# Altium schematic sheet hardware_ProjectFish.SchDoc
size A3
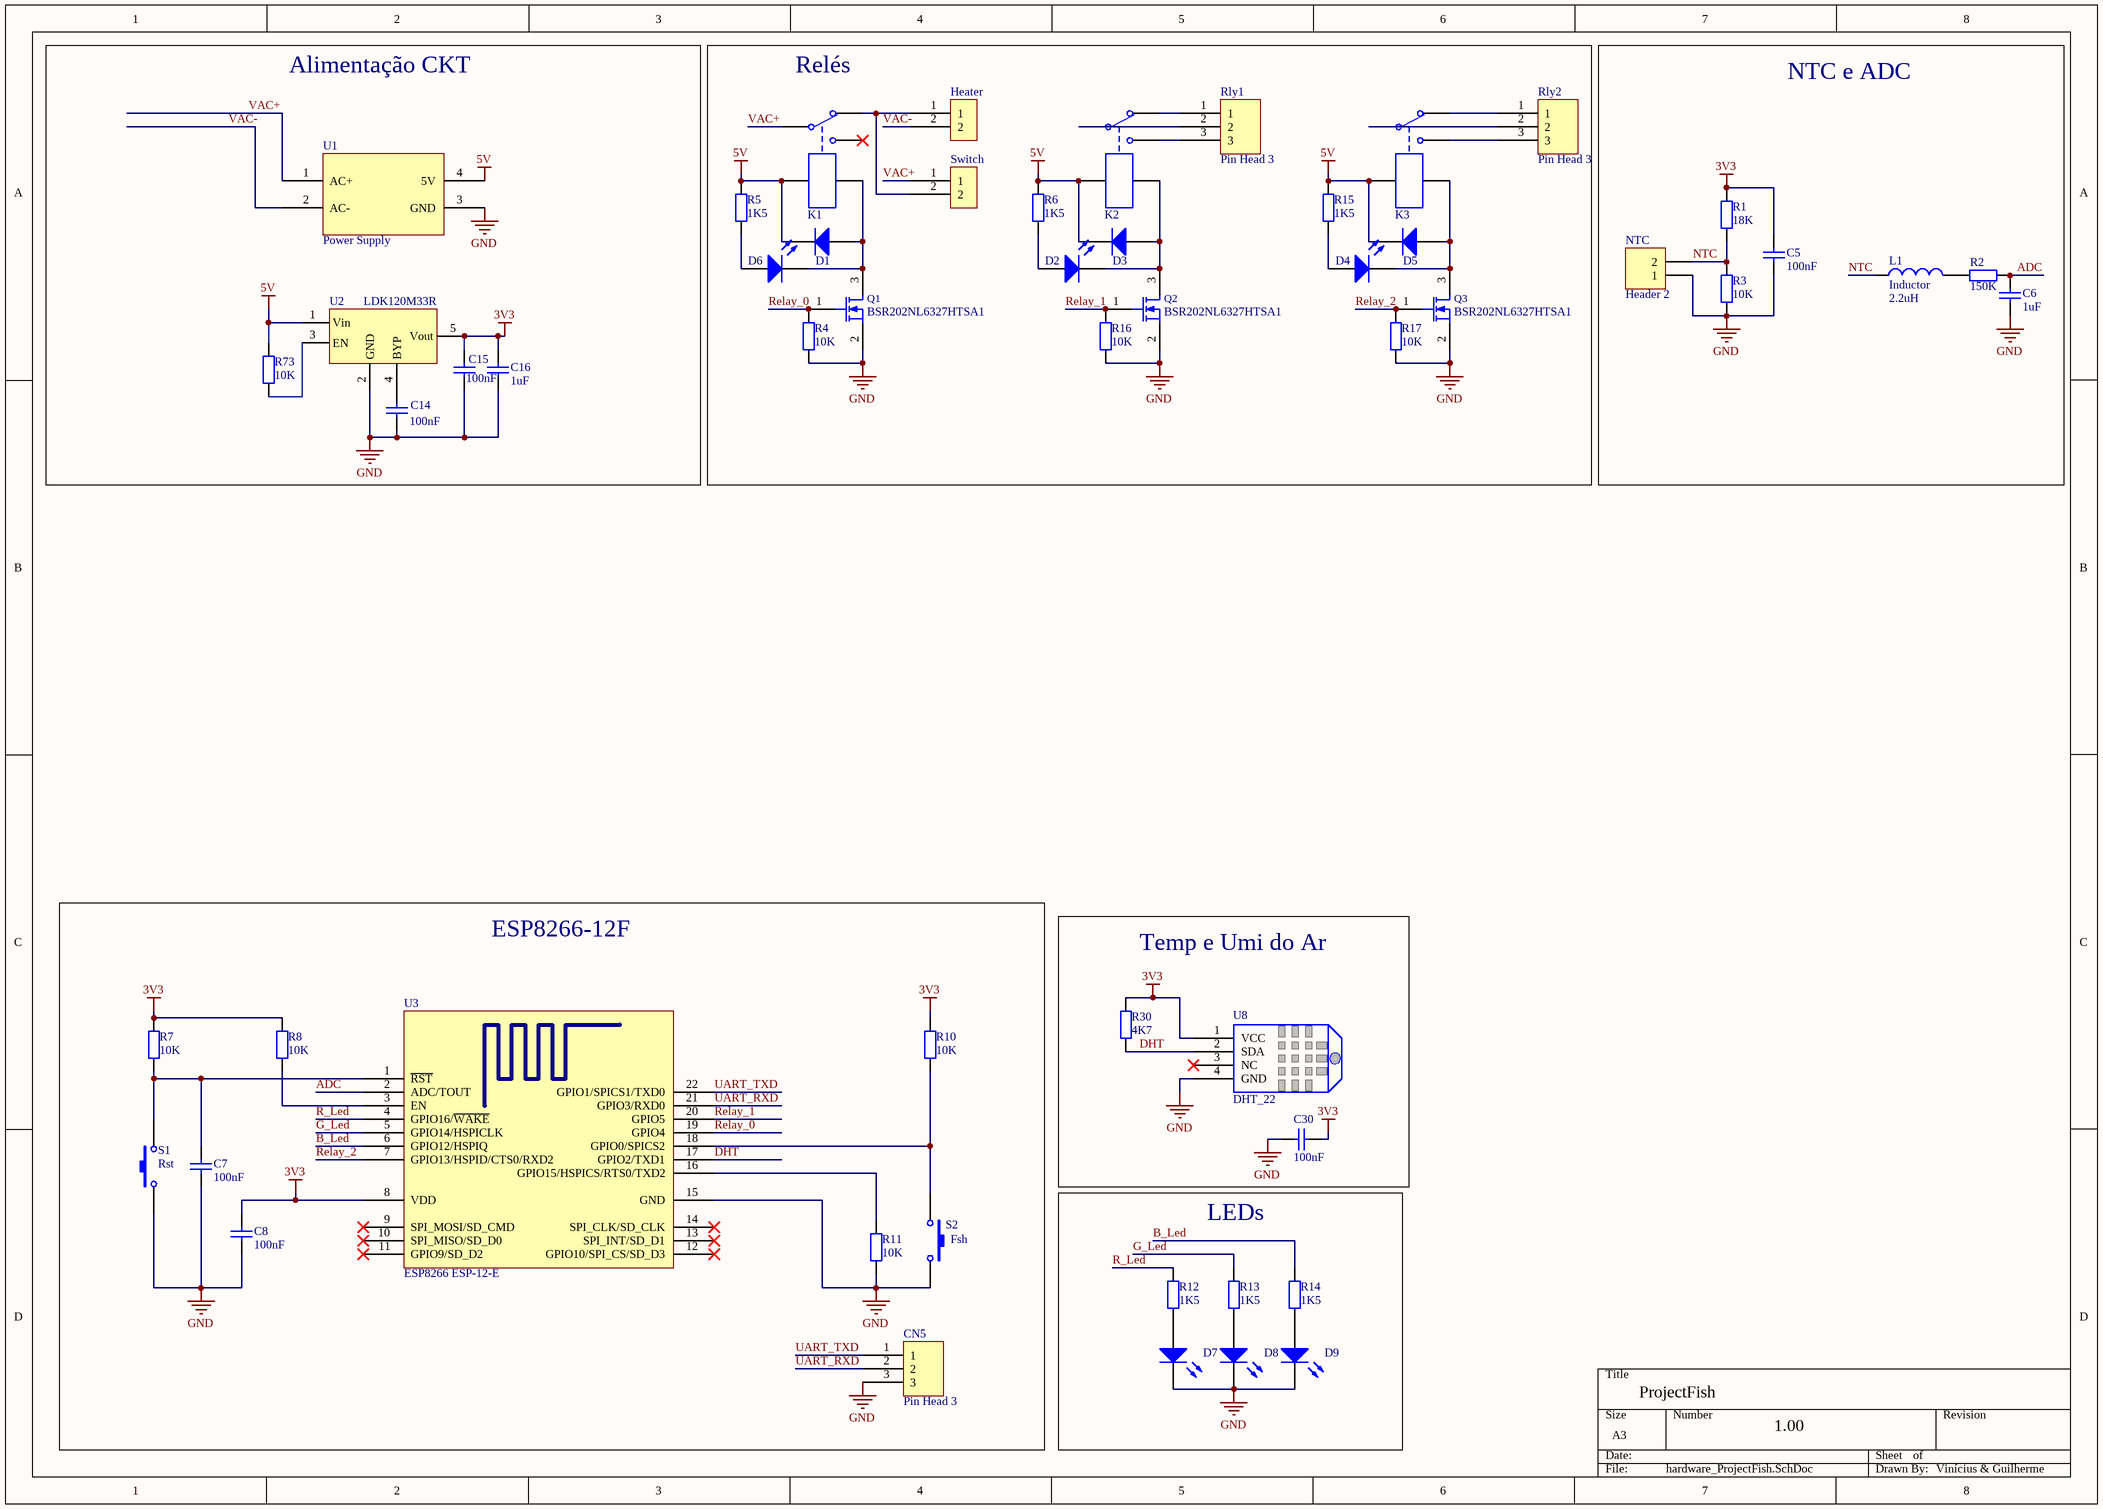
[diagram p0: hardware_ProjectFish.SchDoc]

## Parts
C5  value 100nF  [0805 C]  (hidden comment: Cap-cer-100nF-50V-0805)
C6  value 1uF  [0805 C]  (hidden comment: Cap-cer-1uF-16V-0805)
C7  value 100nF  [0805 C]  (hidden comment: Cap-cer-100nF-50V-0805)
C8  value 100nF  [0805 C]  (hidden comment: Cap-cer-100nF-50V-0805)
C14  value 100nF  [0805 C]  (hidden comment: Capacitor1)
C15  value 100nF  [0805 C]  (hidden comment: Capacitor1)
C16  value 1uF  [0805 C]  (hidden comment: Capacitor1)
C30  value 100nF  [0805 C]  (hidden comment: Capacitor1)
CN5  Pin Head 3  [PIN HEAD 3]
D1  Diode 1N4007  [DO-214AC]  (value not drawn)
D2  LED  [0805 LED]  (value not drawn)
D3  Diode 1N4007  [DO-214AC]  (value not drawn)
D4  LED  [0805 LED]  (value not drawn)
D5  Diode 1N4007  [DO-214AC]  (value not drawn)
D6  LED  [0805 LED]  (value not drawn)
D7  LED  [0805 LED]  (value not drawn)
D8  LED  [0805 LED]  (value not drawn)
D9  LED  [0805 LED]  (value not drawn)
Heater  Pin Head 2  [KRM mini]  (value not drawn)
K1  Relay  [Relay]  (value not drawn)
K2  Relay  [Relay]  (value not drawn)
K3  Relay  [Relay]  (value not drawn)
L1  Inductor  value 2.2uH  [0805 R]
NTC  Header 2  [HDR1X2]
Q1  BSR202NL6327HTSA1  [BSR202NL]
Q2  BSR202NL6327HTSA1  [BSR202NL]
Q3  BSR202NL6327HTSA1  [BSR202NL]
R1  value 18K  [0805 R]  (hidden comment: Res-18K-0805-1%-1/8W)
R2  value 150K  [0805 R]  (hidden comment: Res-150K-0805-1%-1/8W)
R3  value 10K  [0805 R]  (hidden comment: Res-10K-0805-1%-1/8W)
R4  value 10K  [0805 R]  (hidden comment: Res-10K-0805-1%-1/8W)
R5  value 1K5  [0805 R]  (hidden comment: Res-1K8-0805-1%-1/8W)
R6  value 1K5  [0805 R]  (hidden comment: Res-1K8-0805-1%-1/8W)
R7  value 10K  [0805 R]  (hidden comment: Res-10K-0805-1%-1/8W)
R8  value 10K  [0805 R]  (hidden comment: Res-10K-0805-1%-1/8W)
R10  value 10K  [0805 R]  (hidden comment: Res-10K-0805-1%-1/8W)
R11  value 10K  [0805 R]  (hidden comment: Res-10K-0805-1%-1/8W)
R12  value 1K5  [0805 R]  (hidden comment: Res-1K5-0805-1%-1/8W)
R13  value 1K5  [0805 R]  (hidden comment: Res-1K5-0805-1%-1/8W)
R14  value 1K5  [0805 R]  (hidden comment: Res-1K5-0805-1%-1/8W)
R15  value 1K5  [0805 R]  (hidden comment: Res-1K8-0805-1%-1/8W)
R16  value 10K  [0805 R]  (hidden comment: Res-10K-0805-1%-1/8W)
R17  value 10K  [0805 R]  (hidden comment: Res-10K-0805-1%-1/8W)
R30  value 4K7  [0805 R]  (hidden comment: Resistor1)
R73  value 10K  [0805 R]  (hidden comment: Resistor1)
Rly1  Pin Head 3  [KRM 3]
Rly2  Pin Head 3  [KRM 3]
S1  Rst  [Button_SMD]
S2  Fsh  [Button_SMD]
Switch  Pin Head 2  [KRM mini]  (value not drawn)
U1  Power Supply  [Sanmim SM-PLF12B]
U2  LDK120M33R  [SOT-23-5]
U3  ESP8266 ESP-12-E  [ESP8266 ESP-12-E]
U8  DHT_22  [Pin Head 4]

## Blocks framed on the sheet
Alimentação CKT: C14-C16 R73 U1 U2
Relés: D1-D6 Heater K1-K3 Q1-Q3 R4-R6 R15-R17 Rly1 Rly2 Switch
NTC e ADC: C5 C6 L1 NTC R1-R3
ESP8266-12F: C7 C8 CN5 R7 R8 R10 R11 S1 S2 U3
Temp e Umi do Ar: C30 R30 U8
LEDs: D7-D9 R12-R14

## Nets
3V3: C5.1 C8.1 C15.2 C16.2 C30.2 R1.2 R7.2 R8.2 R10.2 R30.1 U2.5(Vout) U3.8(VDD) U8.1(VCC)
5V: D1.2(K) D3.2(K) D5.2(K) K1.4 K2.4 K3.4 R5.2 R6.2 R15.2 R73.1 U1.4(5V) U2.1(Vin)
GND: C5.2 C6.1 C7.1 C8.2 C14.1 C15.1 C16.1 C30.1 CN5.3 D7.2(K) D8.2(K) D9.2(K) NTC.1 Q1.2(S) Q2.2(S) Q3.2(S) R3.1 R4.1 R11.1 R16.1 R17.1 S1.1 S2.1 U1.3(GND) U2.2(GND) U3.15(GND) U8.4(GND)
ADC: C6.2 R2.2 U3.2(ADC/TOUT)
B_Led: R14.2 U3.6(GPIO12/HSPIQ)
DHT: R30.2 U3.17(GPIO2/TXD1) U8.2(SDA)
G_Led: R13.2 U3.5(GPIO14/HSPICLK)
NTC: L1.1 NTC.2 R1.1 R3.2
R_Led: R12.2 U3.4(GPIO16/~{WAKE})
Relay_0: Q1.1(G) R4.2 U3.19(GPIO4)
Relay_1: Q2.1(G) R16.2 U3.20(GPIO5)
Relay_2: Q3.1(G) R17.2 U3.7(GPIO13/HSPID/CTS0/RXD2)
UART_RXD: CN5.2 U3.21(GPIO3/RXD0)
UART_TXD: CN5.1 U3.22(GPIO1/SPICS1/TXD0)
VAC+: K1.1 Switch.1 U1.1(AC+)
VAC-: Heater.2 U1.2(AC-)
NetC7_2: C7.2 R7.1 S1.2 U3.1(~{RST})
NetC14_2: C14.2 U2.4(BYP)
NetD1_1: D1.1(A) D6.2(K) K1.5 Q1.3(D)
NetD2_1: D2.1(A) R6.1
NetD2_2: D2.2(K) D3.1(A) K2.5 Q2.3(D)
NetD4_1: D4.1(A) R15.1
NetD4_2: D4.2(K) D5.1(A) K3.5 Q3.3(D)
NetD6_1: D6.1(A) R5.1
NetD7_1: D7.1(A) R12.1
NetD8_1: D8.1(A) R13.1
NetD9_1: D9.1(A) R14.1
NetHeater_1: Heater.1 K1.2 Switch.2
NetK2_1: K2.1 Rly1.2
NetK2_2: K2.2 Rly1.1
NetK2_3: K2.3 Rly1.3
NetK3_1: K3.1 Rly2.2
NetK3_2: K3.2 Rly2.1
NetK3_3: K3.3 Rly2.3
NetL1_2: L1.2 R2.1
NetR8_1: R8.1 U3.3(EN)
NetR10_1: R10.1 S2.2 U3.18(GPIO0/SPICS2)
NetR11_2: R11.2 U3.16(GPIO15/HSPICS/RTS0/TXD2)
NetR73_2: R73.2 U2.3(EN)

Not connected (* = marked no-connect by the designer): K1 3*; U3 9(SPI_MOSI/SD_CMD)* 10(SPI_MISO/SD_D0)* 11(GPIO9/SD_D2)* 12(GPIO10/SPI_CS/SD_D3)* 13(SPI_INT/SD_D1)* 14(SPI_CLK/SD_CLK)*; U8 3(NC)*

## Notes on the sheet
- ProjectFish
- 1.00
- Vinícius & Guilherme

## Library data of the parts
C5 C7 C8 = Cap-cer-100nF-50V-0805: Capacitor, ceramic, 100nF, 50V, 0805; Part Number: RK-cer-100nF-50V-0805
C6 = Cap-cer-1uF-16V-0805: Capacitor, ceramic, 1uF, 16V, 0805; Part Number: RK-cer-1uF-16V-0805
C14-C16 C30 = Capacitor1: Capacitor (Semiconductor SIM Model); Published: 8-Jun-2000; LatestRevisionDate: 29-May-2009; LatestRevisionNote: IPC-7351 Footprint Added.; PackageReference: C1206; Publisher: Altium Limited; PackageDescription: Chip Capacitor
D1 D3 D5 = Diode 1N4007: 1 Amp General Purpose Rectifier; Published: 8-Jun-2000; LatestRevisionDate: 17-Jul-2002; LatestRevisionNote: Re-released for DXP Platform.; DatasheetVersion: 1998; PackageVersion: Aug-1999; PackageReference: DO-41; Publisher: Altium Limited; PackageDescription: Diode, Axial; Body 5.2 x 2.7 mm (LxDia. max), Lead Dia. 0.86 mm (max); Code_JEDEC: DO-204-AL; ComponentLink1Description: Manufacturer Link; ComponentLink1URL: http://www.fairchildsemi.com/; ComponentLink2Description: Datasheet; ComponentLink2URL: http://www.fairchildsemi.com/ds/1N%2F1N4001.pdf
L1 = Inductor: Code_IEC: 1005; Published: 8-Jun-2000; LatestRevisionDate: 29-May-2009; LatestRevisionNote: IPC-7351 Footprint Added.; PackageReference: 0402-A; Publisher: Altium Limited; PackageDescription: Chip Inductor; Code_JEITA: 0402
NTC = Header 2: Header, 2-Pin; LatestRevisionDate: 17-Jul-2002; LatestRevisionNote: Re-released for DXP Platform.; Publisher: Altium Limited
Q1-Q3 = MOSFET-N: N-Channel MOSFET; Published: 8-Jun-2000; LatestRevisionDate: 17-Jul-2002; LatestRevisionNote: Re-released for DXP Platform.; PackageVersion: 1995/1996; PackageReference: E3; Publisher: Altium Limited; PackageDescription: TO, Flat Index; 3 In-Line, Axial Leads; Body Dia. 4.6mm; Lead Dia. 0.5 mm (max)
R1 = Res-18K-0805-1%-1/8W: Resistor, 18K, 0805, 1%, 1/8W; Part Number: RK-18K-0805-1%-1/8W
R2 = Res-150K-0805-1%-1/8W: Resistor, 150K, 0805, 1%, 1/8W; Part Number: RK-150K-0805-1%-1/8W
R3 R4 R7 R8 R10 R11 R16 R17 = Res-10K-0805-1%-1/8W: Resistor, 10K, 0805, 1%, 1/8W; Part Number: RK-10K-0805-1%-1/8W
R5 R6 R15 = Res-1K8-0805-1%-1/8W: Resistor, 1K8, 0805, 1%, 1/8W; Part Number: RK-1K8-0805-1%-1/8W
R12-R14 = Res-1K5-0805-1%-1/8W: Resistor, 1K,5 0805, 1%, 1/8W; Part Number: RK-1K5-0805-1%-1/8W
R30 R73 = Resistor1: Resistor; Published: 8-Jun-2000; LatestRevisionDate: 17-Jul-2002; LatestRevisionNote: Re-released for DXP Platform.; PackageReference: AXIAL-0.4; Publisher: Altium Limited; PackageDescription: Axial Device, Thru-Hole; 2 Leads; 0.4 in Pin Spacing
S1 S2 = SW-PB: Switch NA
U1 = SANMIM SM-PLF12B: AC/DC switch 5V@2A power supply
U2 = LDK120M33R: Voltage Regulator